# EAGLE design MainHubPCB (EAGLE 9.3.0)
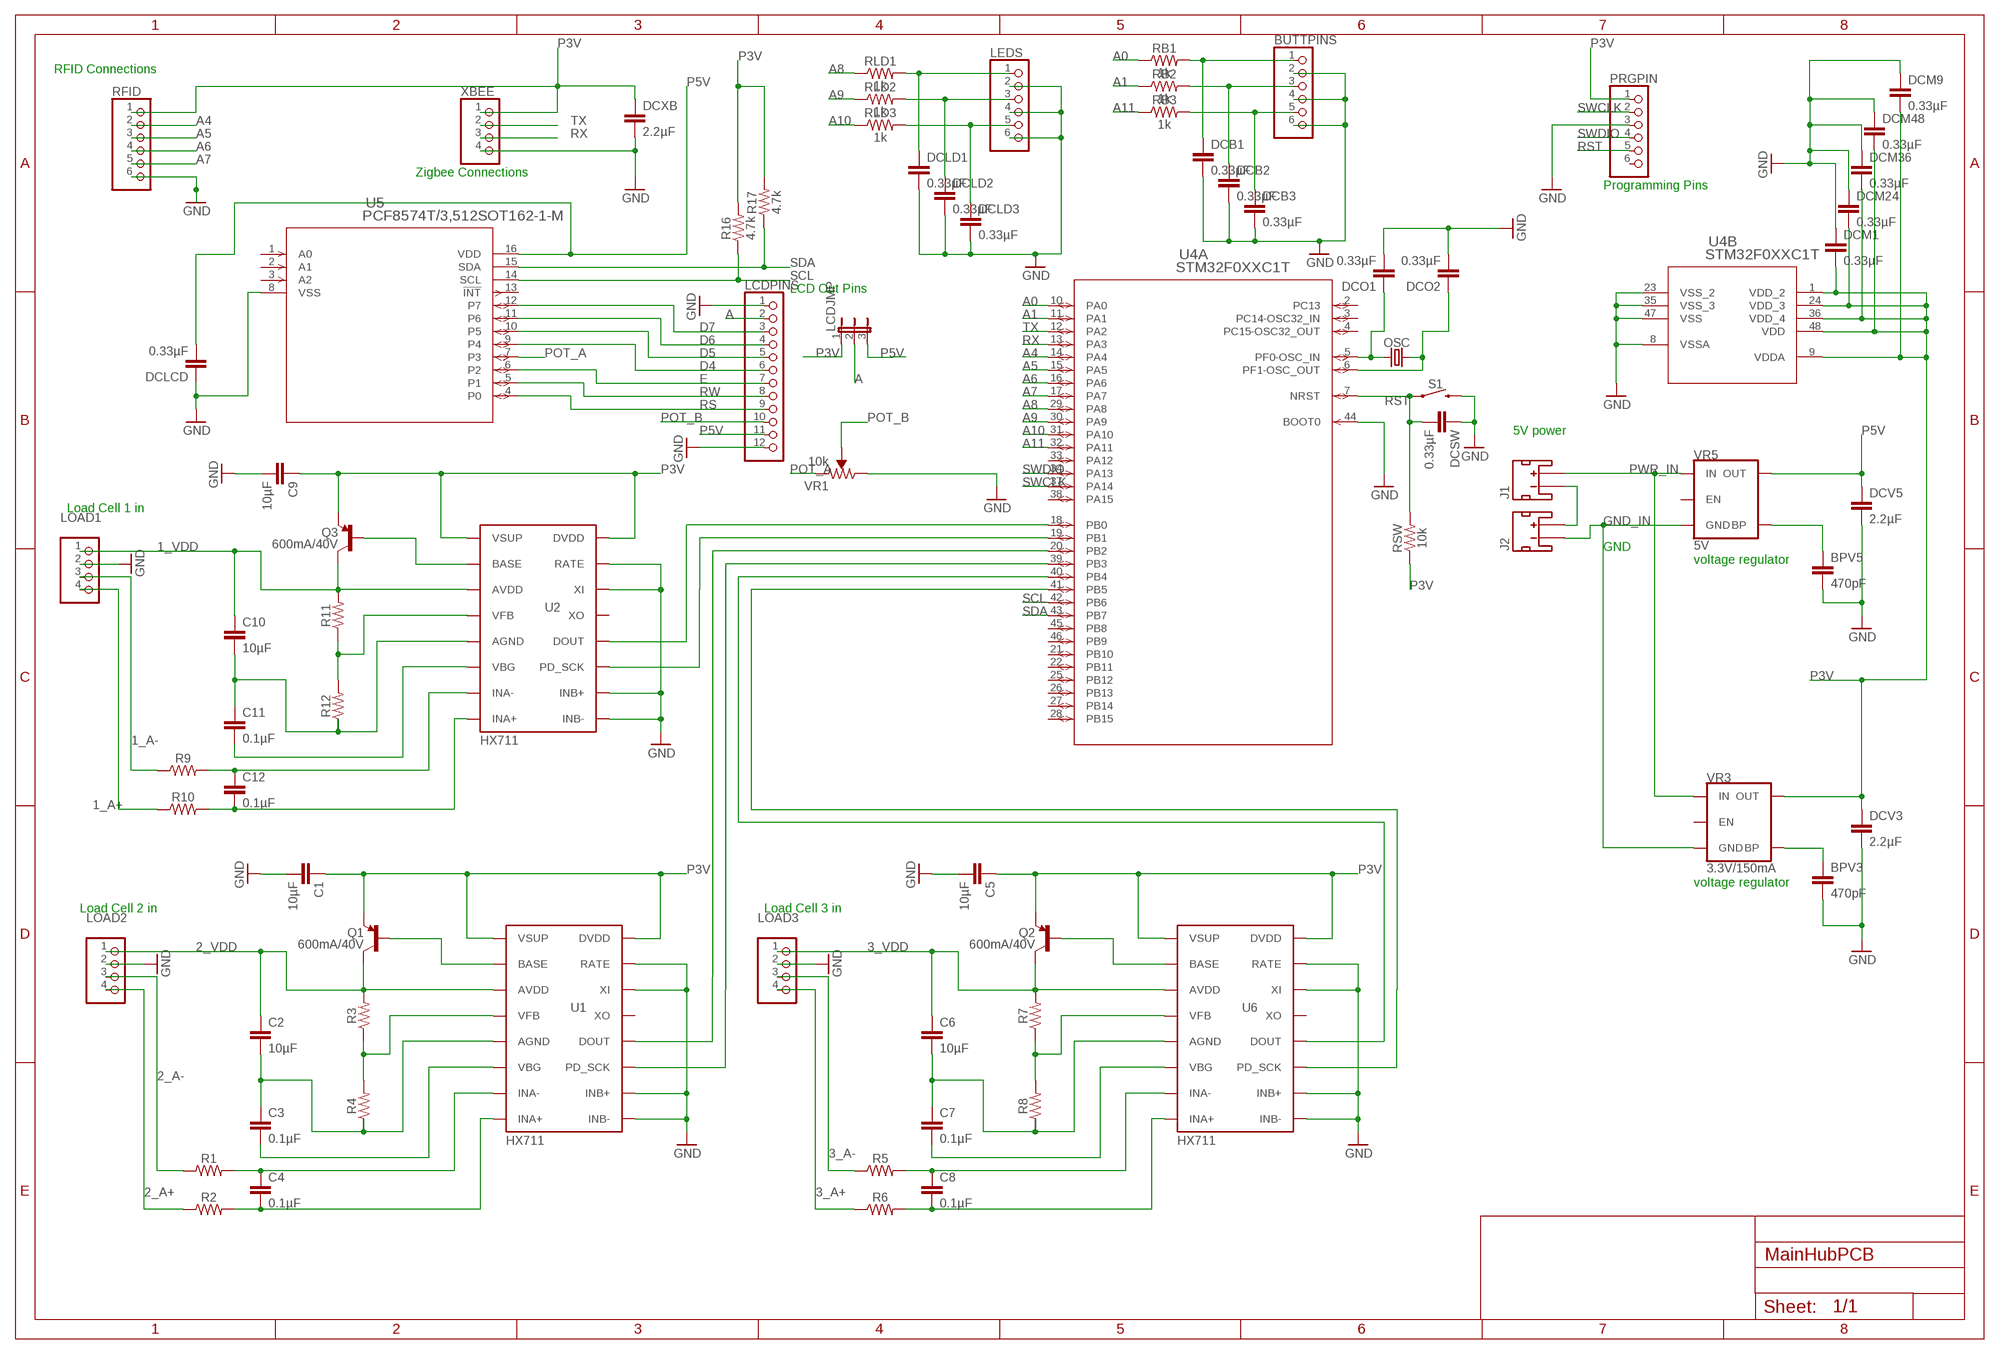
[diagram p0: schematic, sheet 1]

## Parts
BPV3  470pF  0.33UF/330NF-0805-50V-10%  [0805]
BPV5  470pF  0.33UF/330NF-0805-50V-10%  [0805]
BUTTPINS  PINHD-1X6  [1X06]
C1  10µF  0.33UF/330NF-0805-50V-10%  [0805]
C2  10µF  0.33UF/330NF-0805-50V-10%  [0805]
C3  0.1µF  0.33UF/330NF-0805-50V-10%  [0805]
C4  0.1µF  0.33UF/330NF-0805-50V-10%  [0805]
C5  10µF  0.33UF/330NF-0805-50V-10%  [0805]
C6  10µF  0.33UF/330NF-0805-50V-10%  [0805]
C7  0.1µF  0.33UF/330NF-0805-50V-10%  [0805]
C8  0.1µF  0.33UF/330NF-0805-50V-10%  [0805]
C9  10µF  0.33UF/330NF-0805-50V-10%  [0805]
C10  10µF  0.33UF/330NF-0805-50V-10%  [0805]
C11  0.1µF  0.33UF/330NF-0805-50V-10%  [0805]
C12  0.1µF  0.33UF/330NF-0805-50V-10%  [0805]
DCB1  0.33µF  0.33UF/330NF-0805-50V-10%  [0805]
DCB2  0.33µF  0.33UF/330NF-0805-50V-10%  [0805]
DCB3  0.33µF  0.33UF/330NF-0805-50V-10%  [0805]
DCLCD  0.33µF  0.33UF/330NF-0805-50V-10%  [0805]
DCLD1  0.33µF  0.33UF/330NF-0805-50V-10%  [0805]
DCLD2  0.33µF  0.33UF/330NF-0805-50V-10%  [0805]
DCLD3  0.33µF  0.33UF/330NF-0805-50V-10%  [0805]
DCM1  0.33µF  0.33UF/330NF-0805-50V-10%  [0805]
DCM9  0.33µF  0.33UF/330NF-0805-50V-10%  [0805]
DCM24  0.33µF  0.33UF/330NF-0805-50V-10%  [0805]
DCM36  0.33µF  0.33UF/330NF-0805-50V-10%  [0805]
DCM48  0.33µF  0.33UF/330NF-0805-50V-10%  [0805]
DCO1  0.33µF  0.33UF/330NF-0805-50V-10%  [0805]
DCO2  0.33µF  0.33UF/330NF-0805-50V-10%  [0805]
DCSW  0.33µF  0.33UF/330NF-0805-50V-10%  [0805]
DCV3  2.2µF  0.33UF/330NF-0805-50V-10%  [0805]
DCV5  2.2µF  0.33UF/330NF-0805-50V-10%  [0805]
DCXB  2.2µF  0.33UF/330NF-0805-50V-10%  [0805]
J1  JST_2MM_MALE  [JST-2-SMD]
J2  JST_2MM_MALE  [JST-2-SMD]
LCDJMP  JP2E  [JP2]
LCDPINS  PINHD-1X12  [1X12]
LEDS  PINHD-1X6  [1X06]
LOAD1  PINHD-1X4  [1X04]
LOAD2  PINHD-1X4  [1X04]
LOAD3  PINHD-1X4  [1X04]
OSC  CRYSTALPTH-HC49US  [HC49US]
PRGPIN  PINHD-1X6  [1X06]
Q1  600mA/40V  TRANS_PNP-MMBT4403  [SOT23-3]
Q2  600mA/40V  TRANS_PNP-MMBT4403  [SOT23-3]
Q3  600mA/40V  TRANS_PNP-MMBT4403  [SOT23-3]
R1  RESISTOR0805  [0805]
R2  RESISTOR0805  [0805]
R3  RESISTOR0805  [0805]
R4  RESISTOR0805  [0805]
R5  RESISTOR0805  [0805]
R6  RESISTOR0805  [0805]
R7  RESISTOR0805  [0805]
R8  RESISTOR0805  [0805]
R9  RESISTOR0805  [0805]
R10  RESISTOR0805  [0805]
R11  RESISTOR0805  [0805]
R12  RESISTOR0805  [0805]
R16  4.7k  RESISTOR0805  [0805]
R17  4.7k  RESISTOR0805  [0805]
RB1  1k  RESISTOR0805  [0805]
RB2  1k  RESISTOR0805  [0805]
RB3  1k  RESISTOR0805  [0805]
RFID  PINHD-1X6  [1X06]
RLD1  1k  RESISTOR0805  [0805]
RLD2  1k  RESISTOR0805  [0805]
RLD3  1k  RESISTOR0805  [0805]
RSW  10k  RESISTOR0805  [0805]
S1  MOMENTARY-SWITCH-SPST-SMD-5.2MM  [TACTILE_SWITCH_SMD_5.2MM]
U1  HX711  [SO16]
U2  HX711  [SO16]
U4  STM32F0XXC1T  [LQFP48-7X7MM]
U5  PCF8574T/3,512SOT162-1-M  [SOT162-1-M]
U6  HX711  [SO16]
VR1  10k  TRIMPOT-PTH-10MM-KNOB-1/2W-10%  [TRIMPOT-PTH-3386U]
VR3  3.3V/150mA  V_REG_MIC52053.3V  [SOT23-5]
VR5  5V  V_REG_MIC52055V  [SOT23-5]
XBEE  PINHD-1X4  [1X04]

## Nets
1_A+: LOAD1.4 R10.1
1_A-: LOAD1.3 R9.1
1_VDD: C10.1 LOAD1.1 Q3.3(C) R11.2 U2.3(AVDD)
2_A+: LOAD2.4 R2.1
2_A-: LOAD2.3 R1.1
2_VDD: C2.1 LOAD2.1 Q1.3(C) R3.2 U1.3(AVDD)
3_A+: LOAD3.4 R6.1
3_A-: LOAD3.3 R5.1
3_VDD: C6.1 LOAD3.1 Q2.3(C) R7.2 U6.3(AVDD)
A: LCDJMP.2 LCDPINS.2
A0: RB1.1 U4.10(A:PA0)
A1: RB2.1 U4.11(A:PA1)
A4: RFID.2 U4.14(A:PA4)
A5: RFID.3 U4.15(A:PA5)
A6: RFID.4 U4.16(A:PA6)
A7: RFID.5 U4.17(A:PA7)
A8: RLD1.1 U4.29(A:PA8)
A9: RLD2.1 U4.30(A:PA9)
A10: RLD3.1 U4.31(A:PA10)
A11: RB3.1 U4.32(A:PA11)
D4: LCDPINS.6 U5.9(P4)
D5: LCDPINS.5 U5.10(P5)
D6: LCDPINS.4 U5.11(P6)
D7: LCDPINS.3 U5.12(P7)
E: LCDPINS.7 U5.6(P2)
GND: BPV3.2 BPV5.2 BUTTPINS.2 BUTTPINS.4 BUTTPINS.6 C1.2 C5.2 C9.2 DCB1.2 DCB2.2 DCB3.2 DCLCD.1 DCLD1.2 DCLD2.2 DCLD3.2 DCM1.1 DCM9.1 DCM24.1 DCM36.1 DCM48.1 DCO1.2 DCO2.2 DCSW.1 DCV3.2 DCV5.2 DCXB.2 LCDPINS.1 LCDPINS.12 LEDS.2 LEDS.4 LEDS.6 LOAD1.2 LOAD2.2 LOAD3.2 PRGPIN.3 RFID.6 S1.3 U1.9(INB-) U1.10(INB+) U1.14(XI) U1.15(RATE) U2.9(INB-) U2.10(INB+) U2.14(XI) U2.15(RATE) U4.8(B:VSSA) U4.23(B:VSS_2) U4.35(B:VSS_3) U4.44(A:BOOT0) U4.47(B:VSS) U5.8(VSS) U6.9(INB-) U6.10(INB+) U6.14(XI) U6.15(RATE) VR1.3(CW) XBEE.4
GND_IN: J2.1(-) VR3.2(GND) VR5.2(GND)
N$1: J1.1(-) J2.2(+)
N$4: C4.1 R1.2 U1.7(INA-)
N$5: C4.2 R2.2 U1.8(INA+)
N$6: Q1.1(B) U1.2(BASE)
N$8: C2.2 C3.1 R4.1 U1.5(AGND)
N$9: R3.1 R4.2 U1.4(VFB)
N$10: DCLD1.1 LEDS.1 RLD1.2
N$11: C3.2 U1.6(VBG)
N$14: C8.1 R5.2 U6.7(INA-)
N$15: C8.2 R6.2 U6.8(INA+)
N$16: Q2.1(B) U6.2(BASE)
N$18: C6.2 C7.1 R8.1 U6.5(AGND)
N$19: R7.1 R8.2 U6.4(VFB)
N$20: C7.2 U6.6(VBG)
N$21: DCO1.1 OSC.1 U4.5(A:PF0-OSC_IN)
N$22: DCO2.1 OSC.2 U4.6(A:PF1-OSC_OUT)
N$25: C12.1 R9.2 U2.7(INA-)
N$26: C12.2 R10.2 U2.8(INA+)
N$27: Q3.1(B) U2.2(BASE)
N$29: C10.2 C11.1 R12.1 U2.5(AGND)
N$30: R11.1 R12.2 U2.4(VFB)
N$31: C11.2 U2.6(VBG)
N$32: DCLD2.1 LEDS.3 RLD2.2
N$33: DCLD3.1 LEDS.5 RLD3.2
N$34: BPV3.1 VR3.4(BP)
N$35: BUTTPINS.1 DCB1.1 RB1.2
N$36: BUTTPINS.3 DCB2.1 RB2.2
N$37: BPV5.1 VR5.4(BP)
N$38: BUTTPINS.5 DCB3.1 RB3.2
N$54: U4.41(A:PB5) U6.11(PD_SCK)
N$55: U4.40(A:PB4) U6.12(DOUT)
N$56: U1.11(PD_SCK) U4.39(A:PB3)
N$57: U1.12(DOUT) U4.20(A:PB2)
N$58: U2.11(PD_SCK) U4.19(A:PB1)
N$59: U2.12(DOUT) U4.18(A:PB0)
P3V: C1.1 C5.1 C9.1 DCM1.2 DCM9.2 DCM24.2 DCM36.2 DCM48.2 DCV3.1 DCXB.1 LCDJMP.1 PRGPIN.1 Q1.2(E) Q2.2(E) Q3.2(E) R16.2 R17.2 RFID.1 RSW.1 U1.1(VSUP) U1.16(DVDD) U2.1(VSUP) U2.16(DVDD) U4.1(B:VDD_2) U4.9(B:VDDA) U4.24(B:VDD_3) U4.36(B:VDD_4) U4.48(B:VDD) U6.1(VSUP) U6.16(DVDD) VR3.5(OUT) XBEE.1
P5V: DCLCD.2 DCV5.1 LCDJMP.3 LCDPINS.11 U5.16(VDD) VR5.5(OUT)
POT_A: U5.7(P3) VR1.1(CCW)
POT_B: LCDPINS.10 VR1.2(WIPER)
PWR_IN: J1.2(+) VR3.1(IN) VR5.1(IN)
RS: LCDPINS.9 U5.4(P0)
RST: DCSW.2 PRGPIN.5 RSW.2 S1.1 U4.7(A:NRST)
RW: LCDPINS.8 U5.5(P1)
RX: U4.13(A:PA3) XBEE.3
SCL: R16.1 U4.42(A:PB6) U5.14(SCL)
SDA: R17.1 U4.43(A:PB7) U5.15(SDA)
SWCLK: PRGPIN.2 U4.37(A:PA14)
SWDIO: PRGPIN.4 U4.34(A:PA13)
TX: U4.12(A:PA2) XBEE.2
Unconnected: J1.NC1(PAD1) J1.NC2(PAD2) J2.NC1(PAD1) J2.NC2(PAD2) PRGPIN.6 U1.13(XO) U2.13(XO) U4.2(A:PC13) U4.3(A:PC14-OSC32_IN) U4.4(A:PC15-OSC32_OUT) U4.21(A:PB10) U4.22(A:PB11) U4.25(A:PB12) U4.26(A:PB13) U4.27(A:PB14) U4.28(A:PB15) U4.33(A:PA12) U4.38(A:PA15) U4.45(A:PB8) U4.46(A:PB9) U5.1(A0) U5.2(A1) U5.3(A2) U5.13(!INT) U6.13(XO) VR3.3(EN) VR5.3(EN)

## Notes on the sheet
- RFID Connections
- Zigbee Connections
- Programming Pins
- LCD Out Pins
- 5V power
- Load Cell 1 in
- GND
- voltage regulator
- voltage regulator
- Load Cell 2 in | Load Cell 3 in

## Library data of the parts
BPV3 BPV5 C1-C12 DCV3 DCV5 DCXB = SparkFun-Capacitors:0.33UF/330NF: 0.33µF/330nF ceramic capacitors A capacitor is a passive two-terminal electrical component used to store electrical energy temporarily in an electric field.; PROD_ID: CAP-08469; VALUE: 0.33µF
BUTTPINS LEDS PRGPIN RFID = pinhead:PINHD-1X6: PIN HEADER
DCB1-DCB3 DCLCD DCLD1-DCLD3 DCM1 DCM9 DCM24 DCM36 DCM48 DCO1 DCO2 DCSW = SparkFun-Capacitors:0.33UF/330NF: 0.33µF/330nF ceramic capacitors A capacitor is a passive two-terminal electrical component used to store electrical energy temporarily in an electric field.; PROD_ID: CAP-08469
J1 J2 = SparkFun-Connectors:JST_2MM_MALE: JST 2MM MALE RA CONNECTOR Two pin, compact surface mount connector. Commonly used as a battery input connection point. We really like the solid locking feeling and high current rating on these small connectors. We use these all the time as battery connectors. Mates to single-cell LiPo batteries. Here is the connector we sell at SparkFun: JST Right Angle Connector - White <https://www.sparkfun.com/products/8612> (PRT-08612) Datasheet <http://www.sparkfun.com/datasheets/Prototyping/Connectors/JST-Horizontal.pdf> It was used on these SparkFun products: SparkFun MOSFET Power Controller <https://www.sparkfun.com/products/11214> (PRT-11214) SparkFun Battery Babysitter - LiPo Battery Manager <https://www.sparkfun.com/products/13777> (PRT-13777) And many, many others that required a lipo battery connection.; PROD_ID: CONN-11443; SF_ID: PRT-08612
LCDJMP = jumper:JP2E: JUMPER
LCDPINS = pinhead:PINHD-1X12: PIN HEADER
LOAD1-LOAD3 XBEE = pinhead:PINHD-1X4: PIN HEADER
OSC = SparkFun-Clocks:CRYSTAL: Crystals (Generic) These are passive quartz crystals, which can be used as a clock source for a microcontroller. Crystal's are two-terminal devices. They require external "load" capacitors to generate an oscillating signal.
Q1-Q3 = SparkFun-DiscreteSemi:TRANS_PNP: PNP transistor Current controlled devices typically used to amplify current or used as a switch. SparkFun Products: SparkFun Serial Enabled 16x2 LCD - Red on Black <https://www.sparkfun.com/products/9068> SparkFun Logomatic <https://www.sparkfun.com/products/12772>; PROD_ID: TRANS-09245
R1-R12 R16 R17 RB1-RB3 RLD1-RLD3 RSW = SparkFun-Resistors:RESISTOR: Generic Resistor Package
S1 = SparkFun-Switches:MOMENTARY-SWITCH-SPST: Momentary Switch (Pushbutton) - SPST Normally-open (NO) SPST momentary switches (buttons, pushbuttons). Variants PTH-12MM - 12mm square, through-hole Momentary Pushbutton Switch - 12mm Square <https://www.sparkfun.com/products/9190> (COM-09190) PTH-6.0MM, PTH-6.0MM-KIT - 6.0mm square, through-hole Mini Pushbutton Switch <https://www.sparkfun.com/products/97> (COM-00097) KIT package intended for soldering kit's - only one side of pads' copper is exposed. PTH-RIGHT-ANGLE-KIT - Right-angle, through-hole Right Angle Tactile Button <https://www.sparkfun.com/products/10791> - Used on SparkFun BigTime Watch Kit <https://www.sparkfun.com/products/11734> SMD-12MM - 12mm square, surface-mount Tactile Button - SMD (12mm) <https://www.sparkfun.com/products/12993> (COM-12993) Used on SparkFun PicoBoard <https://www.sparkfun.com/products/11888> SMD-4.5MM - 4.5mm Square Trackball Switch Used on SparkFun Blackberry Trackballer Breakout <https://www.sparkfun.com/products/13169> SMD-4.6MMX2.8MM - 4.60mm x 2.80mm, surface mount Used on SparkFun SAMD21 Mini Breakout <https://www.sparkfun.com/products/13664> SMD-5.2MM, SMD-5.2-REDUNDANT - 5.2mm square, surface-mount Mini Pushbutton Switch - SMD <https://www.sparkfun.com/products/8720> (COM-08720) Used on Arduino Pro Mini <https://www.sparkfun.com/products/11114> REDUNDANT package connects both switch circuits together SMD-6.0X3.5MM - 6.0 x 3.5mm, surface mount Momentary Reset Switch SMD <https://www.sparkfun.com/products/8229> (COM-08229) SMD-6.2MM-TALL - 6.2mm square, surface mount Tactile Button - SMD (6mm) <https://www.sparkfun.com/products/12992> Used on SparkFun Digital Sandbox <https://www.sparkfun.com/products/12651> SMD-RIGHT-ANGLE - Right-angle, surface mount Used on SparkFun Block for Intel® Edison - Arduino <https://www.sparkfun.com/products/13036>; PROD_ID: SWCH-08247; SF_SKU: COM-08720
U1 U2 U6 = SparkFun-IC-Conversion:HX711: AVIA Semiconductor HX711 - ADC 24-Bit Analog-to-Digital Converter for Weigh Scales Datasheet <https://cdn.sparkfun.com/datasheets/Sensors/ForceFlex/hx711_english.pdf> SparkFun Products: SparkFun Load Cell Amplifier - HX711 <https://www.sparkfun.com/products/13879>; PROD_ID: IC-12445
U4 = ECE477_Resources:STM32F0XXC1T; MANUFACTURER_PART_NUMBER: stm32f0xxc1t; VENDOR: STMicroelectronics
U5 = ECE477_Resources:PCF8574T/3,512; MANUFACTURER_PART_NUMBER: PCF8574T3512; VENDOR: NXP
VR1 = SparkFun-Resistors:TRIMPOT: Trimming Potentiometer (Trimpot) Three-terminal potentiometers, with an adjustable wiper and two adjustable resistors. A pot can be used to create a configurable voltage divider, or as a variable resistor. "Trimpots" are a subset of potentiometers, usually intended for "set-and-forget" applications. They're often more delicate than standard potentiometers - rated for fewer turns. Variants PTH-KNOB - PTH Trimpot w/ finger-adjustable knob Trimpot 10K with Knob <https://www.sparkfun.com/products/9806> (COM-09806) Datasheet <http://www.sparkfun.com/datasheets/Components/General/TSR-3386.pdf> SMD-3MM-CLOSED-FRAME - SMD 3mm Square Closed-Frame Trimpot Used on e.g. EasyDriver - Stepper Motor Driver <https://www.sparkfun.com/products/12779> Datasheet <http://www.bitechnologies.com/pdfs/22.pdf> (22AR10KTR) SMD-5MM - SMD 5mm Square Closed-Frame Trimpot Used on e.g. IOIO-OTG - V2.2 <https://www.sparkfun.com/products/13613> Datasheet <http://www.vishay.com/docs/51008/ts53.pdf> (TS53YL502MR10) SMD-3MM-1/10W-25% - 3mm Square Open-Frame Trimpot Used on e.g. SparkFun Shapeoko <https://www.sparkfun.com/products/13899> Datasheet <http://www.bourns.com/docs/Product-Datasheets/TC33.pdf> (TC33X-2-103E); PROD_ID: RES-09730; SF_SKU: COM-09806
VR3 = SparkFun-IC-Power:V_REG_MIC5205: V_REG MIC5205 Standard 3.3V, 5V, and Adjustable 150mA LDO voltage regulator in SOT-23 layout. Micrel part MIC5205. BP (by-pass) pin is used to lower output noise with 470pF cap, may be left open. On the adjustable version BP is used to set output.; PROD_ID: VREG-00822
VR5 = SparkFun-IC-Power:V_REG_MIC5205: V_REG MIC5205 Standard 3.3V, 5V, and Adjustable 150mA LDO voltage regulator in SOT-23 layout. Micrel part MIC5205. BP (by-pass) pin is used to lower output noise with 470pF cap, may be left open. On the adjustable version BP is used to set output.; PROD_ID: VREG-00823

## Board
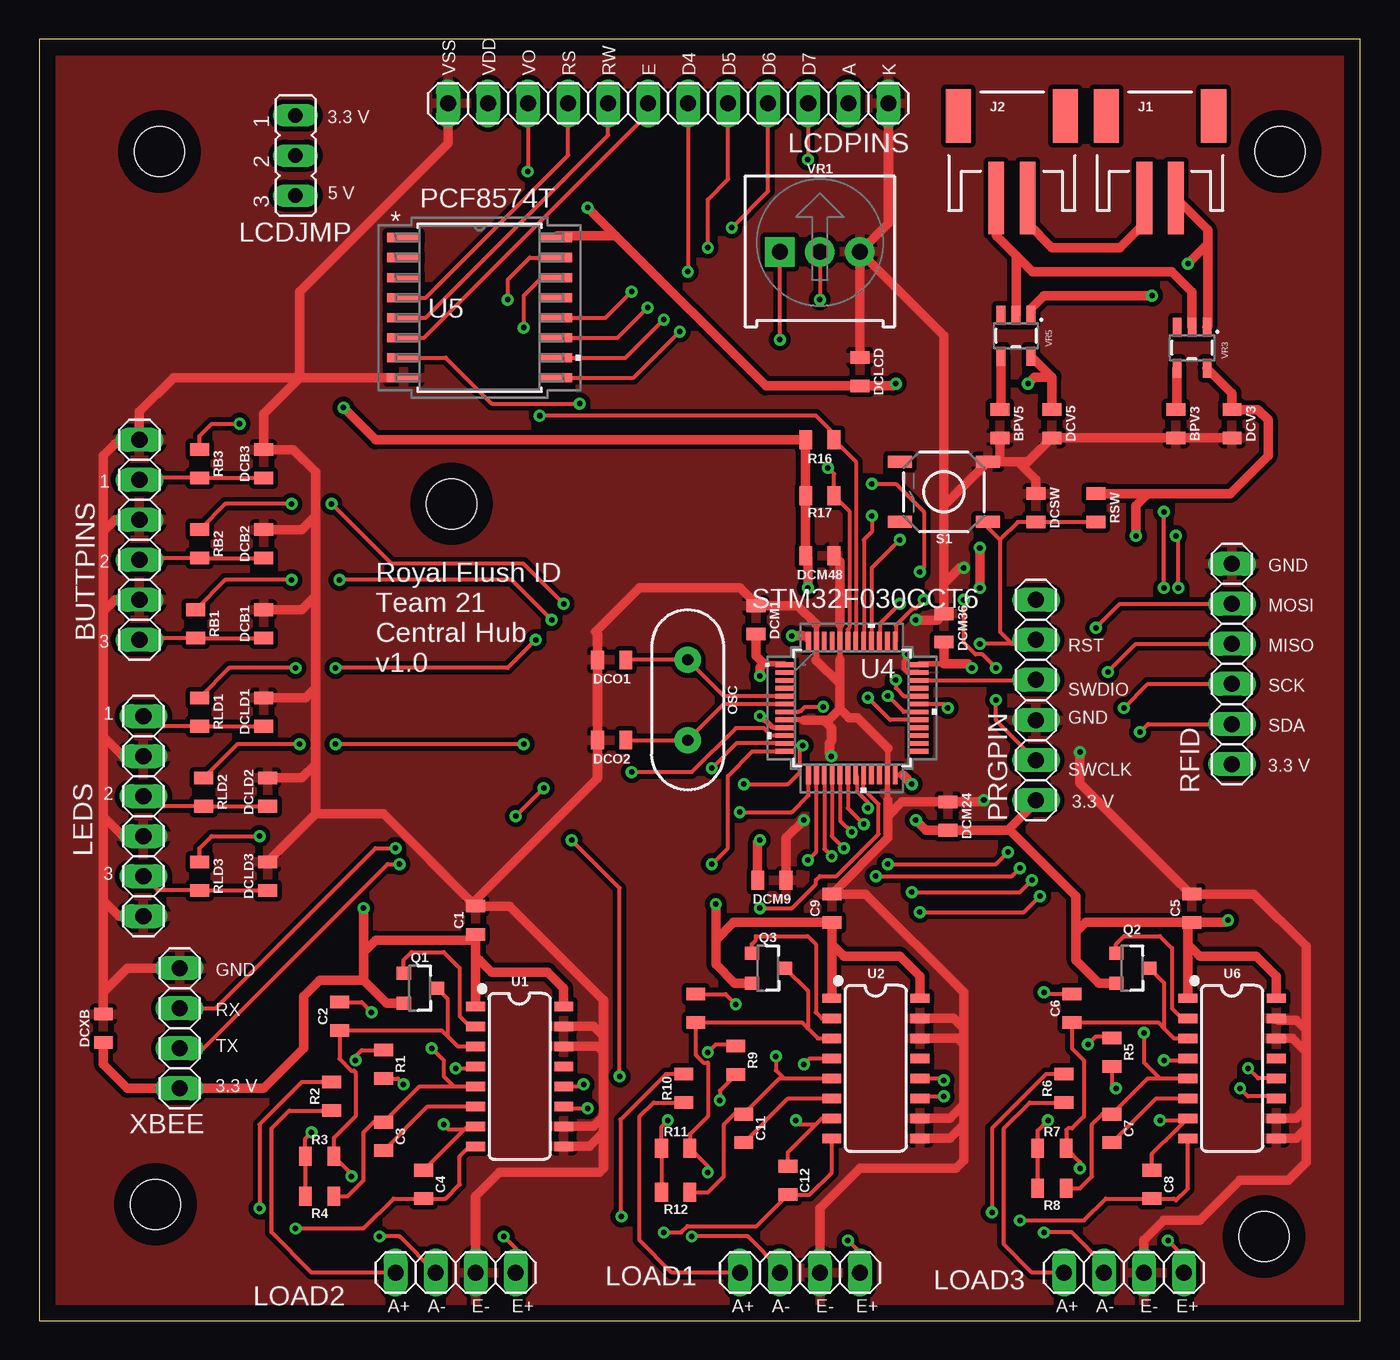
[diagram p1: board, top side]
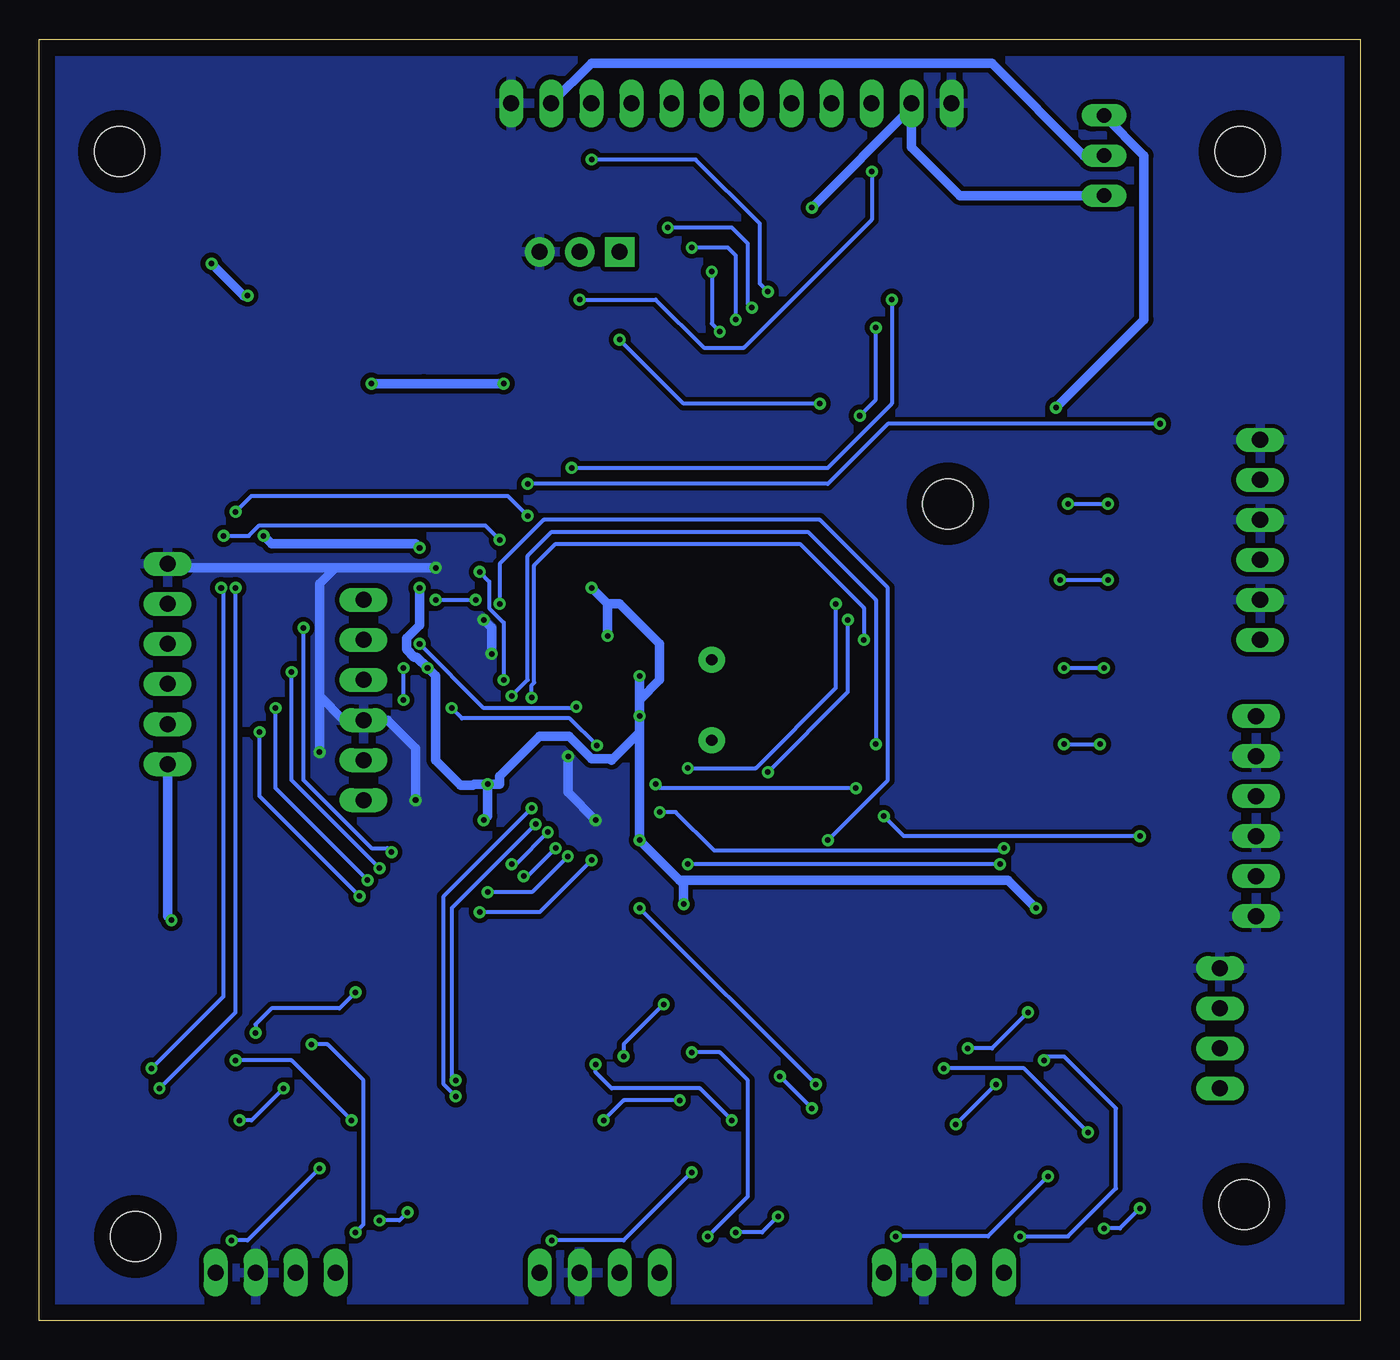
[diagram p2: board, bottom side, seen from below]

Size 83.82 x 81.28 mm. Coordinates in mm from the lower left corner, seen from the top.
Outline: 0,0 83.82,0 83.82,81.28 0,81.28 0,0
Copper layers (1*16): Top 0.035mm / dielectric 1.5mm / Bottom 0.035mm
Design rules "default": minimum track width 6mil, minimum drill 0.35mm, track to track 6mil, track to pad 6mil, pad to pad 6mil, via to via 6mil, smd to smd 6mil, copper to edge 40mil, drill to drill 6mil, minimum pad ring 10mil, minimum via ring 8mil, stop-mask expansion 4mil, vias tented up to drill 0mil, thermal gap 10mil
Holes 3.17 mm at 7.62,74.17 7.37,7.37 77.72,5.33 78.74,74.17 26.16,51.82

### Footprints (pad centres in the part's own frame; a part is rotated, then mirrored left to right if it is on the bottom)
0805 = smd 0.8 x 1.2: 1 -0.9,0; 2 0.9,0
1X06 = drill 1.016 long: 1 -6.35,0; 2 -3.81,0; 3 -1.27,0; 4 1.27,0; 5 3.81,0; 6 6.35,0
JST-2-SMD = smd 1 x 4.6: 1 -1,-3.7; 2 1,-3.7 | smd 1.6 x 3.4: NC1 -3.4,1.5; NC2 3.4,1.5
JP2 = drill 0.914 long: 1 -2.54,0; 2 0,0; 3 2.54,0
1X12 = drill 1.016 long: 1 -13.97,0; 2 -11.43,0; 3 -8.89,0; 4 -6.35,0; 5 -3.81,0; 6 -1.27,0; 7 1.27,0; 8 3.81,0; 9 6.35,0; 10 8.89,0; 11 11.43,0; 12 13.97,0
1X04 = drill 1.016 long: 1 -3.81,0; 2 -1.27,0; 3 1.27,0; 4 3.81,0
HC49US = drill 0.7 pad 1.651: 1 -2.54,0; 2 2.54,0
SOT23-3 = smd 0.8 x 0.9: 1 -0.95,-1; 2 0.95,-1; 3 0,1.1
TACTILE_SWITCH_SMD_5.2MM = smd 1.524 x 0.762: 1 -2.794,1.905; 2 2.794,1.905; 3 -2.794,-1.905; 4 2.794,-1.905
SO16 = smd 0.6 x 1.2: 1 -4.445,-2.8; 2 -3.175,-2.8; 3 -1.905,-2.8; 4 -0.635,-2.8; 5 0.635,-2.8; 6 1.905,-2.8; 7 3.175,-2.8; 8 4.445,-2.8; 9 4.445,2.8; 10 3.175,2.8; 11 1.905,2.8; 12 0.635,2.8; 13 -0.635,2.8; 14 -1.905,2.8; 15 -3.175,2.8; 16 -4.445,2.8
LQFP48-7X7MM = smd 1.194 x 0.305: 1 -4.25,2.75; 2 -4.25,2.25; 3 -4.25,1.75; 4 -4.25,1.25; 5 -4.25,0.75; 6 -4.25,0.25; 7 -4.25,-0.25; 8 -4.25,-0.75; 9 -4.25,-1.25; 10 -4.25,-1.75; 11 -4.25,-2.25; 12 -4.25,-2.75; 25 4.25,-2.75; 26 4.25,-2.25; 27 4.25,-1.75; 28 4.25,-1.25; 29 4.25,-0.75; 30 4.25,-0.25; 31 4.25,0.25; 32 4.25,0.75; 33 4.25,1.25; 34 4.25,1.75; 35 4.25,2.25; 36 4.25,2.75 | smd 0.305 x 1.194: 13 -2.75,-4.25; 14 -2.25,-4.25; 15 -1.75,-4.25; 16 -1.25,-4.25; 17 -0.75,-4.25; 18 -0.25,-4.25; 19 0.25,-4.25; 20 0.75,-4.25; 21 1.25,-4.25; 22 1.75,-4.25; 23 2.25,-4.25; 24 2.75,-4.25; 37 2.75,4.25; 38 2.25,4.25; 39 1.75,4.25; 40 1.25,4.25; 41 0.75,4.25; 42 0.25,4.25; 43 -0.25,4.25; 44 -0.75,4.25; 45 -1.25,4.25; 46 -1.75,4.25; 47 -2.25,4.25; 48 -2.75,4.25
SOT162-1-M = smd 2.108 x 0.584: 1 -4.826,4.445; 2 -4.826,3.175; 3 -4.826,1.905; 4 -4.826,0.635; 5 -4.826,-0.635; 6 -4.826,-1.905; 7 -4.826,-3.175; 8 -4.826,-4.445; 9 4.826,-4.445; 10 4.826,-3.175; 11 4.826,-1.905; 12 4.826,-0.635; 13 4.826,0.635; 14 4.826,1.905; 15 4.826,3.175; 16 4.826,4.445
TRIMPOT-PTH-3386U = drill 1.016 pad 1.88 square: 1 -2.54,-0.015 | drill 1.016 pad 1.88: 2 0,-0.015; 3 2.54,-0.015
SOT23-5 = smd 0.55 x 1.2: 1 -0.95,-1.3; 2 0,-1.3; 3 0.95,-1.3; 4 0.95,1.3; 5 -0.95,1.3

### Placement (x,y rotation side)
BPV3  72.14,56.9 270 top
BPV5  60.96,56.9 270 top
BUTTPINS  6.35,49.53 90 top
C1  27.69,25.4 90 top
C2  19.05,19.3 90 top
C3  21.84,11.68 270 top
C4  24.38,8.64 270 top
C5  73.15,26.16 90 top
C6  65.53,19.81 90 top
C7  68.07,12.19 270 top
C8  70.61,8.64 270 top
C9  50.29,26.16 90 top
C10  41.66,19.81 90 top
C11  44.7,12.19 270 top
C12  47.5,8.89 270 top
DCB1  14.22,44.2 90 top
DCB2  14.22,49.28 90 top
DCB3  14.22,54.36 90 top
DCLCD  52.07,60.2 270 top
DCLD1  14.22,38.61 90 top
DCLD2  14.48,33.53 90 top
DCLD3  14.48,28.19 90 top
DCM1  45.47,44.45 270 top
DCM9  46.48,27.94 180 top
DCM24  57.66,32 270 top
DCM36  57.4,43.94 270 top
DCM48  49.53,48.51 180 top
DCO1  36.32,41.91 180 top
DCO2  36.32,36.83 180 top
DCSW  63.25,51.56 270 top
DCV3  75.69,56.9 270 top
DCV5  64.26,56.9 270 top
DCXB  4.06,18.54 90 top
J1  71.12,74.93 0 top
J2  61.72,74.93 0 top
LCDJMP  16.26,73.91 270 top
LCDPINS  39.9,77.22 180 top
LEDS  6.6,32 270 top
LOAD1  48.26,3.05 180 top
LOAD2  26.42,3.05 180 top
LOAD3  68.83,3.05 180 top
OSC  41.15,39.37 270 top
PRGPIN  63.25,39.37 90 top
Q1  24.13,21.08 270 top
Q2  69.34,22.35 270 top
Q3  46.23,22.35 270 top
R1  21.84,16.26 270 top
R2  18.54,14.22 90 top
R3  17.78,10.41 0 top
R4  17.78,7.87 180 top
R5  68.07,17.02 270 top
R6  65.02,14.73 90 top
R7  64.26,10.92 0 top
R8  64.26,8.38 180 top
R9  44.2,16.51 270 top
R10  40.89,14.73 90 top
R11  40.39,10.92 0 top
R12  40.39,8.13 180 top
R16  49.53,55.88 180 top
R17  49.53,52.32 180 top
RB1  9.91,44.2 270 top
RB2  10.16,49.28 270 top
RB3  10.16,54.36 270 top
RFID  75.69,41.66 90 top
RLD1  10.16,38.61 270 top
RLD2  10.41,33.53 270 top
RLD3  10.16,28.19 270 top
RSW  67.06,51.56 270 top
S1  57.4,52.58 180 top
U1  30.48,15.49 270 top
U2  53.09,16 270 top
U4  51.56,38.86 0 top
U5  27.94,64.26 0 top
U6  75.69,16 270 top
VR1  49.53,67.82 0 top
VR3  73.15,61.72 180 top
VR5  61.98,62.48 180 top
XBEE  8.89,18.54 90 top

### Tracks (layer width: path | path; a pad name or v marks a point on that pad's centre or on a via)
1_A+
  Top 0.254: LOAD1.4 40.13,3.05 38.1,5.08 38.1,12.95 38.98,13.83 R10.1
1_A-  (via drill 0.35)
  Top 0.254: LOAD1.3 46.99,3.3 44.96,5.33 v41.4,5.33 | v42.42,17.02 42.93,17.53 44.08,17.53 R9.1
  Bottom 0.254: v41.4,5.33 38.86,7.87 38.86,15.24 40.64,17.02 v42.42,17.02
1_VDD  (via drill 0.35)
  Top 0.254: Q3.3 48.77,20.91 48.77,18.54 | 48.77,18.54 49.4,17.91 U2.3 | 48.77,18.54 48.4,18.91 C10.1 41.66,16.85 42.15,16.36 42.42,16.36 42.42,12.95 41.29,11.82 R11.2 42.42,9.79 v42.42,9.4 | v51.31,5.08 52.07,4.32 LOAD1.1
  Bottom 0.254: v42.42,9.4 46.74,5.08 v51.31,5.08
2_A+
  Top 0.254: LOAD2.4 17.27,3.05 14.73,5.59 14.73,12.19 15.86,13.32 R2.1
2_A-  (via drill 0.35)
  Top 0.254: LOAD2.3 22.86,5.33 v21.59,5.33 | v20.07,16.51 20.07,16.76 20.46,17.16 R1.1
  Bottom 0.254: v21.59,5.33 18.54,5.33 15.49,8.38 15.49,13.46 18.8,16.76 19.81,16.76 v20.07,16.51
2_VDD  (via drill 0.35)
  Top 0.254: Q1.3 25.91,20.4 25.91,18.03 | 25.91,18.03 26.54,17.4 U1.3 | 25.91,18.03 25.54,18.4 C2.1 19.05,16.6 19.79,15.85 19.96,15.85 20.07,15.75 20.07,12.95 18.68,11.57 R3.2 19.81,9.28 v19.81,9.14 | v29.46,5.33 30.23,4.57 LOAD2.1
  Bottom 0.254: v19.81,9.14 23.62,5.33 v29.46,5.33
3_A+
  Top 0.254: LOAD3.4 62.99,3.05 61.21,4.83 61.21,12.19 62.85,13.83 R6.1
3_A-  (via drill 0.35)
  Top 0.254: LOAD3.3 67.56,3.56 65.53,5.59 v63.75,5.59 | v66.55,17.53 67.06,18.03 67.96,18.03 R5.1
  Bottom 0.254: v63.75,5.59 63.25,6.1 63.25,15.24 65.53,17.53 v66.55,17.53
3_VDD  (via drill 0.35)
  Top 0.254: Q2.3 71.37,21.42 71.37,18.54 | 71.37,18.54 72.01,17.91 U6.3 | 71.37,18.54 71,18.91 C6.1 65.53,17.27 66.29,16.51 66.29,12.95 65.53,12.19 65.28,12.19 65.16,12.08 R7.2 66.04,10.04 v66.04,9.65 | v71.63,5.08 72.64,4.06 LOAD3.1
  Bottom 0.254: v66.04,9.65 70.61,5.08 v71.63,5.08
A
  Bottom 0.61: LCDJMP.2 17.53,73.91 23.37,79.76 48.79,79.76 LCDPINS.2
A0  (via drill 0.35)
  Top 0.254: U4.10 46.45,37.11 45.97,37.59 44.2,37.59 41.4,34.8 v37.59,34.8 | v32.51,44.45 29.97,46.99 v19.05,46.99 | v16,46.99 11.8,46.99 RB1.1
  Bottom 0.254: v37.59,34.8 32.51,39.88 v32.51,44.45 | v19.05,46.99 v16,46.99
A1  (via drill 0.35)
  Top 0.254: U4.11 44.23,36.61 v42.67,35.05 | v33.27,45.47 30.73,48.01 22.35,48.01 v18.54,51.82 | v16,51.82 11.8,51.82 RB2.1
  Bottom 0.254: v42.67,35.05 38.35,35.05 33.27,40.13 v33.27,45.47 | v18.54,51.82 v16,51.82
A4  (via drill 0.35)
  Top 0.254: U4.14 49.28,34.58 49.28,29.72 v48.77,29.21 | v55.88,25.91 62.48,25.91 v63.5,26.92 | v69.85,37.34 70.36,37.85 RFID.2
  Bottom 0.254: v48.77,29.21 52.07,25.91 v55.88,25.91 | v63.5,26.92 69.85,33.27 v69.85,37.34
A5  (via drill 0.35)
  Top 0.254: U4.15 49.81,29.93 v50.28,29.46 | v55.37,27.18 62.23,27.18 v62.99,27.94 | v68.83,38.86 70.36,40.39 RFID.3
  Bottom 0.254: v50.28,29.46 52.56,27.18 v55.37,27.18 | v62.99,27.94 68.83,33.78 v68.83,38.86
A6  (via drill 0.35)
  Top 0.254: U4.16 50.29,34.59 50.29,30.73 v51.05,29.97 | v53.09,28.19 61.72,28.19 v62.23,28.7 | v67.82,41.15 69.6,42.93 RFID.4
  Bottom 0.254: v51.05,29.97 52.83,28.19 v53.09,28.19 | v62.23,28.7 67.82,34.29 v67.82,41.15
A7  (via drill 0.35)
  Top 0.254: U4.17 50.81,31.72 v51.55,30.98 | v53.85,28.96 60.71,28.96 v61.47,29.72 | v67.06,43.94 68.58,45.47 RFID.5
  Bottom 0.254: v51.55,30.98 53.58,28.96 v53.85,28.96 | v61.47,29.72 61.72,29.97 62.74,29.97 67.06,34.29 v67.06,43.94
A8  (via drill 0.35)
  Top 0.254: U4.29 53.99,38.11 v52.58,39.52 | v31.5,43.18 29.72,41.4 v18.8,41.4 | v16.26,41.4 12.05,41.4 RLD1.1
  Bottom 0.254: v52.58,39.52 52.58,40.32 52.43,40.47 52.43,47.9 51.05,49.28 35.56,49.28 31.5,45.21 v31.5,43.18 | v18.8,41.4 v16.26,41.4
A9  (via drill 0.35)
  Top 0.254: U4.30 54.86,38.61 v53.85,39.62 | v30.73,36.58 v18.8,36.58 | v16.51,36.58 12.56,36.58 RLD2.1
  Bottom 0.254: v53.85,39.62 52.83,40.64 52.83,48.51 51.31,50.04 35.05,50.04 30.73,45.72 30.73,36.83 30.48,36.58 v30.73,36.58 | v18.8,36.58 v16.51,36.58
A10  (via drill 0.35)
  Top 0.254: RLD3.1 10.16,29.97 10.92,30.73 v13.97,30.73 | v30.23,32 v32,33.78 | v44.7,34.04 47.5,34.04 48.26,34.8 48.26,36.32 48.42,36.48 v48.44,36.48 | v57.66,38.86 57.41,39.11 U4.31
  Bottom 0.254: v13.97,30.73 28.96,30.73 v30.23,32 | v32,33.78 44.45,33.78 v44.7,34.04 | v48.44,36.48 50.16,38.2 57,38.2 v57.66,38.86
A11  (via drill 0.35)
  Top 0.254: RB3.1 10.16,56.13 10.92,56.9 v12.7,56.9 | v54.36,40.64 54.36,40.13 54.88,39.61 U4.32 | v52.83,53.09 54.36,53.09 56.13,51.31 56.13,47.75 v55.88,47.5
  Bottom 0.254: v12.7,56.9 29.97,56.9 33.78,53.09 v52.83,53.09 | v54.36,40.64 54.36,44.28 55.27,45.19 55.27,46.89 v55.88,47.5
D4  (via drill 0.35)
  Top 0.254: U5.9 37.72,59.82 v40.64,62.74 | LCDPINS.6 41.17,66.57 v41.15,66.55
  Bottom 0.254: v41.15,66.55 41.15,63.25 v40.64,62.74
D5  (via drill 0.35)
  Top 0.254: U5.10 37.21,61.09 v39.62,63.5 | v42.42,68.07 42.42,71.12 43.71,72.42 LCDPINS.5
  Bottom 0.254: v39.62,63.5 39.62,67.56 40.13,68.07 v42.42,68.07
D6  (via drill 0.35)
  Top 0.254: U5.11 36.7,62.36 v38.61,64.26 | v43.94,69.34 46.25,71.65 LCDPINS.4
  Bottom 0.254: v38.61,64.26 38.86,64.52 38.86,68.33 39.88,69.34 v43.94,69.34
D7  (via drill 0.35)
  Top 0.254: U5.12 35.94,63.63 v37.59,65.28 | LCDPINS.3 48.79,73.69 v48.77,73.66
  Bottom 0.254: v37.59,65.28 38.1,65.79 38.1,69.6 42.16,73.66 v48.77,73.66
E
  Top 0.254: U5.6 24.42,62.36 38.63,76.57 LCDPINS.7
GND  (via drill 0.35)
  Top 0.305: U4.35 55.8,41.13 55.11,41.13 54.91,41.33 54.91,41.89 55.12,42.1 v55.12,42.3 | 48.51,38.1 48.5,38.11 U4.8
  Top 0.356: 53.85,33.02 53.81,33.06 U4.23 53.83,34.63 53.83,35.35 53.85,35.36 53.85,36.32 | 50.81,41.92 U4.44 50.81,44.18 | 49.28,44.2 49.31,44.16 U4.47 49.31,41.91 49.3,41.89
  Top 0.61: 57.4,51.69 S1.3 60.96,54.48 | 57.4,51.69 57.4,46.74 | 57.4,46.74 DCM36.1 57,44.44 55.64,44.44 v55.63,44.45 | v58.67,47.75 58.42,47.75 57.4,46.74 | v59.94,33.02 59.83,32.9 DCM24.1 54.75,32.9 53.85,32 | 60.96,54.48 62.1,54.48 | DCSW.1 63.25,53.34 62.1,54.48 | U5.8 16.51,59.82 | 16.51,59.82 8.51,59.82 6.35,57.66 BUTTPINS.6 6.1,55.63 4.83,55.63 4.06,54.86 4.06,50.04 | 17.53,51.05 17.53,53.85 16.12,55.26 DCB3.2 14.22,57.53 16.51,59.82 | 17.53,51.05 17.53,45.97 | 17.53,45.97 17.53,40.13 | 17.53,40.13 17.53,35.31 | 17.53,35.31 17.53,32.14 | 17.53,32.14 DCLD3.2 | C1.2 27.69,26.67 35.42,34.41 DCO2.2 DCO1.2 35.42,43.57 35.31,43.69 38.1,46.48 44.45,46.48 45.47,45.47 DCM1.1 48.12,45.35 49.28,44.2 | DCLD2.2 16.65,34.43 17.53,35.31 | DCLD1.2 16.9,39.51 17.53,40.13 | DCB1.2 16.65,45.1 17.53,45.97 | DCB2.2 16.65,50.18 17.53,51.05 | XBEE.4 5.59,22.35 4.06,20.83 | 4.06,20.83 DCXB.2 | 4.06,44.96 4.06,37.08 | 4.06,37.08 4.06,32 | 4.06,32 4.06,26.67 | 4.06,26.67 4.06,20.83 | BUTTPINS.2 4.83,45.72 4.06,44.96 | BUTTPINS.4 4.83,50.8 4.06,50.04 | 4.06,50.04 4.06,44.96 | U1.15 35.18,18.67 35.81,18.03 | 35.81,18.03 35.81,17.02 | 35.81,17.02 35.81,12.95 | 35.81,12.95 35.81,11.94 | U1.9 34.92,11.05 35.81,11.94 | U1.10 35.18,12.32 35.81,12.95 | U1.14 35.43,17.4 35.81,17.02 | U6.15 78.62,19.05 79.76,19.05 80.39,18.41 | 80.39,18.41 80.39,17.02 | 80.39,17.02 80.39,13.46 | 80.39,13.46 80.39,12.19 | 80.39,12.19 79.76,11.56 U6.9 | U6.10 79.76,12.83 80.39,13.46 | U6.14 79.5,17.91 80.39,17.02 | U2.9 57.78,11.56 58.67,12.45 | 58.67,12.45 58.67,13.72 | 58.67,13.72 58.67,17.53 | 58.67,17.53 58.67,18.54 | 58.67,18.54 58.04,19.18 U2.15 | U2.14 58.29,17.91 58.67,17.53
  Top 0.61: 35.81,18.03 35.81,20.32 29.83,26.3 C1.2 | C1.2 21.84,32.14 17.53,32.14 | 53.85,32 53.85,30.62 C9.2 52.44,27.06 58.67,20.83 58.67,18.54 | 53.85,33.02 53.85,32 | 80.39,18.41 80.39,23.75 77.08,27.06 C5.2 73.06,27.06 66.04,34.09 v66.04,36.07 | BPV5.2 60.96,54.48 | 62.1,54.48 62.75,54.48 DCV5.2 BPV3.2 DCV3.2 | VR1.3 57.4,62.47 57.4,51.69 | U2.10 57.78,12.83 58.67,13.72 | VR1.3 DCLCD.1 | 80.39,12.19 80.39,10.03 79.25,8.89 76.2,8.89 73.66,6.35 71.37,6.35 70.1,5.08 LOAD3.2 | 58.67,12.45 58.67,10.16 58.17,9.65 52.07,9.65 49.53,7.11 LOAD1.2 | 35.81,11.94 35.81,9.65 35.56,9.4 29.21,9.4 27.69,7.87 LOAD2.2 | 53.85,36.32 51.93,38.24 51.39,38.24 50.81,38.82 | 49.3,41.89 50.8,40.39 50.8,39.62 50.81,39.64 | 50.81,41.92 50.81,39.64 | DCM48.1 50.81,48.13 50.81,44.18 | LEDS.2 5.33,35.81 4.06,37.08 | LEDS.4 5.33,30.73 4.06,32 | LEDS.6 5.08,25.65 4.06,26.67 | DCM9.1 47.38,30.62 v48.51,31.75 | 49.78,38.1 50.27,37.62 50.27,36.75 50.15,36.64 50.15,36.01 50.27,35.89 v50.27,35.79 | 49.78,38.1 49.02,38.1 48.51,38.1 | 49.78,38.1 50.09,38.1 50.81,38.82 | 50.81,39.64 50.81,38.82 | LCDPINS.1 53.87,69.61 VR1.3 | 16.51,59.82 16.51,65.28 25.93,74.7 LCDPINS.12
  Bottom 0.61: 66.04,39.62 64.52,38.1 PRGPIN.3 61.72,38.1 59.94,36.32 v59.94,33.02 | 66.04,39.62 66.04,46.74 65.02,47.75 | 65.02,47.75 v58.67,47.75 | v66.04,36.07 66.04,39.62 | RFID.6 75.44,47.75 65.02,47.75 | v55.12,42.3 55.12,43.94 v55.63,44.45 | v48.51,31.75 50.27,33.5 v50.27,35.79
  pour Top (isolate 0.305): 0.76,80.26 83.06,80.26 83.06,0.76 0.76,0.76
  pour Bottom (isolate 0.305): 0.76,80.26 83.06,80.26 83.06,0.76 0.76,0.76
GND_IN
  Top 0.61: J2.1 60.72,68.83 61.99,67.56 | 61.99,67.56 61.99,63.8 VR5.2 | VR3.2 73.15,65.28 71.88,66.55 63.01,66.55 61.99,67.56
N$1
  Top 0.61: J1.1 70.12,69.61 68.58,68.07 64.26,68.07 62.72,69.61 J2.2
N$4  (via drill 0.35)
  Top 0.254: C4.1 26.98,12.13 | 26.98,12.13 27.17,12.32 U1.7 | R1.2 22.74,15.36 v23.11,14.99 | v25.65,12.45 25.97,12.13 26.98,12.13
  Bottom 0.254: v23.11,14.99 v25.65,12.45
N$5  (via drill 0.35)
  Top 0.254: U1.8 27.3,11.05 26.67,10.41 26.67,8.64 25.77,7.74 C4.2 22.47,7.74 20.57,5.84 v16.26,5.84 | R2.2 16.65,15.12 13.97,12.45 v13.97,7.11
  Bottom 0.254: v13.97,7.11 15.24,5.84 v16.26,5.84
N$6
  Top 0.254: Q1.1 23.13,22.88 23.62,23.37 25.65,23.37 26.67,22.35 26.67,19.3 27.3,18.67 U1.2
N$8  (via drill 0.35)
  Top 0.254: C3.1 22.03,12.77 | 22.03,12.77 24.12,14.86 26.29,14.86 | 26.29,14.86 U1.5 | C2.2 20.44,20.2 v21.08,19.56 | v24.89,17.27 25.65,16.51 25.65,15.49 26.29,14.86 | R4.1 19.56,7.87 20.57,8.89 20.57,11.94 21.41,12.77 22.03,12.77
  Bottom 0.254: v21.08,19.56 23.37,17.27 v24.89,17.27
N$9  (via drill 0.35)
  Top 0.254: R4.2 R3.1 16.88,11.55 v17.27,11.94 | v26.42,16 27.55,16 U1.4
  Bottom 0.254: v17.27,11.94 21.34,16 v26.42,16
N$10
  Top 0.254: DCLD1.1 RLD1.2 7.25,37.71 LEDS.1
N$11
  Top 0.254: C3.2 24.65,13.59 U1.6
N$14  (via drill 0.35)
  Top 0.254: C8.1 70.61,10.57 72.18,12.14 72.2,12.14 U6.7 72.77,12.7 v71.12,12.7 | R5.2 68.07,14.99 v68.33,14.73
  Bottom 0.254: v68.33,14.73 70.36,12.7 v71.12,12.7
N$15  (via drill 0.35)
  Top 0.254: U6.8 72.89,8.38 72.14,7.62 72.02,7.74 C8.2 67.68,7.74 66.29,6.35 v62.23,6.35 | R6.2 63.89,15.63 60.45,12.19 v60.45,6.86
  Bottom 0.254: v60.45,6.86 60.96,6.35 v62.23,6.35
N$16
  Top 0.254: Q2.1 68.33,23.32 68.33,23.88 68.83,24.38 71.12,24.38 71.88,23.62 71.88,19.81 72.52,19.18 U6.2
N$18  (via drill 0.35)
  Top 0.254: 71.12,15.37 70.35,15.37 C7.1 67.45,13.09 66.8,12.45 66.8,9.14 66.04,8.38 R8.1 | 71.12,15.37 U6.5 | C6.2 63.87,20.71 v63.75,20.83 | v70.1,18.25 70.1,16.38 71.12,15.37
  Bottom 0.254: v63.75,20.83 64.77,19.81 69.09,19.81 70.1,18.8 v70.1,18.25
N$19  (via drill 0.35)
  Top 0.254: R8.2 R7.1 63.36,12.05 v64.01,12.7 | v71.37,16.51 72.77,16.51 U6.4
  Bottom 0.254: v64.01,12.7 67.82,16.51 v71.37,16.51
N$20
  Top 0.254: C7.2 70.88,14.1 U6.6
N$21
  Top 0.254: U4.5 43.45,39.61 OSC.1 DCO1.1
N$22
  Top 0.254: U4.6 43.43,39.11 OSC.2 DCO2.1
N$25  (via drill 0.35)
  Top 0.254: C12.1 47.5,10.67 49.28,12.45 | 49.28,12.45 49.66,12.83 U2.7 | R9.2 43.18,14.59 v43.18,13.97 | v48.01,12.7 48.26,12.45 49.28,12.45
  Bottom 0.254: v43.18,13.97 46.74,13.97 v48.01,12.7
N$26  (via drill 0.35)
  Top 0.254: U2.8 50.29,9.39 48.88,7.99 C12.2 45.5,5.99 41.13,5.99 40.73,5.59 v39.62,5.59 | R10.2 39.76,15.63 36.88,12.75 36.88,6.66 v36.93,6.6
  Bottom 0.254: v36.93,6.6 37.95,5.59 v39.62,5.59
N$27
  Top 0.254: Q3.1 45.21,23.32 45.21,23.88 45.47,24.13 45.47,24.38 48.77,24.38 49.28,23.88 49.28,19.56 49.66,19.18 U2.2
N$29  (via drill 0.35)
  Top 0.254: C11.1 44.76,13.15 | 44.76,13.15 46.98,15.37 47.24,15.37 | 47.24,15.37 U2.5 | C10.2 43.55,20.71 v44.2,20.07 | v46.74,16.76 46.74,15.88 47.24,15.37 | R12.1 42.42,8.13 43.43,9.14 43.43,12.45 44.14,13.15 44.76,13.15
  Bottom 0.254: v44.2,20.07 46.74,17.53 v46.74,16.76
N$30  (via drill 0.35)
  Top 0.254: R12.2 R11.1 39.49,12.31 v39.88,12.7 | v48.51,16.26 48.9,16.64 U2.4
  Bottom 0.254: v39.88,12.7 41.91,14.73 47.5,14.73 48.51,15.75 v48.51,16.26
N$31
  Top 0.254: C11.2 47.51,14.1 U2.6
N$32
  Top 0.254: DCLD2.1 RLD2.2 7.25,32.63 LEDS.3
N$33
  Top 0.254: DCLD3.1 RLD3.2 7.5,27.29 LEDS.5
N$34
  Top 0.61: VR3.4 72.2,57.86 BPV3.1
N$35
  Top 0.254: DCB1.1 RB1.2 6.47,43.3 BUTTPINS.1
N$36
  Top 0.254: DCB2.1 RB2.2 6.47,48.38 BUTTPINS.3
N$37
  Top 0.61: VR5.4 61.03,57.86 BPV5.1
N$38
  Top 0.254: DCB3.1 RB3.2 6.47,53.46 BUTTPINS.5
N$54  (via drill 0.35)
  Top 0.254: U6.11 78.36,14.22 76.71,14.22 v76.2,14.73 | v71.37,46.48 v71.37,51.31 | v52.83,51.05 52.83,50.04 52.32,49.53 52.32,43.12 U4.41
  Bottom 0.254: v76.2,14.73 71.37,19.56 v71.37,46.48 | v71.37,51.31 70.36,52.32 54.1,52.32 v52.83,51.05
N$55  (via drill 0.35)
  Top 0.254: U6.12 77.34,15.37 v76.71,16 | v72.28,46.48 72.28,49.64 v72.14,49.78 | v54.61,49.53 52.81,47.73 U4.40
  Bottom 0.254: v76.71,16 72.14,20.57 72.14,46.48 v72.28,46.48 | v72.14,49.78 70.53,49.78 69.87,50.44 55.52,50.44 v54.61,49.53
N$56  (via drill 0.35)
  Top 0.254: U1.11 33.41,13.46 v34.8,13.46 | v36.83,15.49 36.83,27.43 v33.78,30.48 | U4.39 53.34,43.14 53.34,44.2 v54.61,45.47
  Bottom 0.254: v34.8,13.46 v36.83,15.49 | v33.78,30.48 29.97,34.29 29.97,46.48 34.29,50.8 51.82,50.8 54.61,48.01 v54.61,45.47
N$57  (via drill 0.35)
  Top 0.254: U1.12 34.42,14.86 v34.54,14.99 | v45.72,26.16 47.75,26.16 49.28,27.69 49.28,27.94 49.53,28.19 50.6,28.19 53.26,30.86 53.26,32.77 52.31,33.72 U4.20
  Bottom 0.254: v34.54,14.99 v45.72,26.16
N$58  (via drill 0.35)
  Top 0.254: U2.11 56.01,14.22 v57.4,14.22 | U4.19 51.88,34.54 51.88,33.58 52.58,32.88 v52.58,32.51
  Bottom 0.254: v57.4,14.22 58.17,14.99 58.17,26.92 v52.58,32.51
N$59  (via drill 0.35)
  Top 0.254: U2.12 57.28,15.37 v57.4,15.24 | U4.18 51.31,32.51 v52.32,31.5
  Bottom 0.254: v57.4,15.24 57.66,15.49 57.66,26.16 v52.32,31.5
P3V  (via drill 0.35)
  Top 0.305: U4.24 54.8,34.61 | U4.48 48.49,43.43 | U4.9 46.56,37.61 46.15,38.02 46.05,38.02 v45.72,38.35
  Top 0.356: U4.36 55.86,41.66 57.4,41.66 | U4.1 47.27,41.66 45.97,41.66
  Top 0.61: PRGPIN.1 62.99,32.77 63.13,32.77 61.54,31.17 | 61.54,31.17 61.47,31.1 DCM24.2 56.27,31.1 v55.63,31.75 | U6.1 72.89,23.88 | 72.89,23.88 72.89,25 C5.1 | U6.16 78.49,21.84 77.22,23.11 73.65,23.11 72.89,23.88 | Q2.2 67.24,21.4 65.79,22.86 65.79,24.64 | 65.79,24.64 66.41,25.26 C5.1 | U2.1 50.29,23.88 | 50.29,23.88 C9.1 44.06,25.26 42.93,24.13 | U2.16 55.89,21.84 54.61,23.11 51.05,23.11 50.29,23.88 | Q3.2 44.13,21.4 42.93,22.61 42.93,24.13 | U1.1 27.69,22.86 | 27.69,22.86 C1.1 27.32,24.13 21.34,24.13 20.57,23.37 | U1.16 33.28,21.08 32.26,22.1 28.7,22.1 27.94,22.86 27.69,22.86 | Q1.2 22.03,20.13 20.57,21.59 | 20.57,21.59 20.57,23.37 | DCXB.1 4.06,16.26 5.59,14.73 XBEE.1 14.22,14.73 16.76,17.27 16.76,20.57 17.78,21.59 20.57,21.59 | v59.18,41.4 58.93,41.66 57.4,41.66 DCM36.2 | DCM1.2 45.47,42.16 45.97,41.66 45.72,41.4 v45.72,40.89 | v48.77,46.48 48.77,48.38 DCM48.2 R17.2 R16.2 21.34,55.88 v19.3,57.91 | 65.79,24.64 65.79,26.92 61.54,31.17 | 20.57,23.37 v20.57,26.16 | 42.93,24.13 v42.93,26.42 | VR3.5 75.69,58.83 DCV3.1 77.33,57.8 77.98,57.15 77.98,54.86 75.58,52.46 70.36,52.46 | 70.36,52.46 RSW.1 | v59.69,46.48 v59.69,49.02 | v69.6,49.78 69.6,51.7 70.36,52.46 | C5.1 75.3,25.26 v75.44,25.4 | 54.8,34.61 v55.37,34.04 | 48.49,43.43 v47.75,43.43 | DCM9.2 45.58,30.34 v45.72,30.48
  Bottom 0.61: v55.37,34.04 54.61,34.04 54.61,34.54 52.07,37.08 50.22,37.08 48.79,35.65 47.59,35.65 47.5,35.56 45.72,37.34 | v55.63,31.75 55.37,32 v55.37,34.04 | v55.37,34.04 56.22,34.04 56.3,33.96 57.08,33.96 58.67,35.56 58.67,40.89 v59.18,41.4 59.87,42.09 60.04,42.09 60.52,42.58 60.52,43.27 59.69,44.11 v59.69,46.48 | v45.72,40.89 45.72,39.37 | 45.72,39.37 v45.72,38.35 45.72,37.34 | v47.75,43.43 47.75,45.47 | 47.75,45.47 v48.77,46.48 | 47.75,45.47 46.99,45.47 44.45,42.93 44.45,40.64 45.72,39.37 | v20.57,26.16 22.35,27.94 43.18,27.94 | 43.18,27.94 v45.72,30.48 45.72,37.34 | v42.93,26.42 42.93,27.69 43.18,27.94 | v59.69,49.02 59.94,49.28 69.09,49.28 v69.6,49.78 | RFID.1 75.69,25.65 v75.44,25.4 | v19.3,57.91 13.72,63.5 13.72,73.91 LCDJMP.1
P5V  (via drill 0.35)
  Top 0.61: DCV5.1 64.26,59.85 | 64.26,59.85 VR5.5 | 64.26,59.85 63.15,59.85 v62.74,59.44 | v54.36,59.44 54.22,59.3 DCLCD.2 46.11,59.3 36.58,68.83 | 36.58,68.83 32.89,68.83 U5.16 | 36.58,68.83 v34.8,70.61
  Bottom 0.61: v62.74,59.44 59.44,59.44 v54.36,59.44 | v34.8,70.61 28.47,76.94 LCDPINS.11 28.47,74.45 25.4,71.37 LCDJMP.3
POT_A  (via drill 0.35)
  Top 0.254: U5.7 25.78,61.09 28.7,58.17 v34.29,58.17 | v46.99,62.23 VR1.1
  Bottom 0.254: v34.29,58.17 42.93,58.17 v46.99,62.23
POT_B  (via drill 0.35)
  Top 0.254: VR1.2 v49.53,64.77 | LCDPINS.10 31.01,72.92 v30.99,72.9
  Bottom 0.254: v49.53,64.77 44.7,64.77 41.66,61.72 39.12,61.72 30.99,69.85 v30.99,72.9
PWR_IN  (via drill 0.35)
  Top 0.61: 74.15,68.31 74.15,63.07 VR3.1 | v70.61,65.02 63.75,65.02 62.93,64.2 VR5.1 | v72.9,67.06 74.15,68.31 | J1.2 74.15,69.2 74.15,68.31
  Bottom 0.61: v70.61,65.02 70.87,65.02 v72.9,67.06
RS
  Top 0.254: U5.4 24.51,64.9 33.55,73.94 LCDPINS.9
RST  (via drill 0.35)
  Top 0.254: 61.72,42.93 v59.69,42.93 | 61.72,42.93 62.99,42.93 PRGPIN.5 | S1.1 60.2,50.29 60.96,49.53 | 61.72,42.93 60.96,43.69 60.96,49.53 | 60.96,49.53 62.09,50.66 DCSW.2 RSW.2 | U4.7 48.2,38.61 48.27,38.68 48.34,38.68 48.59,38.94 v49.75,38.94
  Bottom 0.254: v59.69,42.93 55.63,38.86 49.82,38.86 v49.75,38.94
RW
  Top 0.254: U5.5 24.51,63.63 36.09,75.21 LCDPINS.8
RX  (via drill 0.35)
  Top 0.254: XBEE.3 11.18,19.81 21.34,29.97 v22.61,29.97 | v44.45,32.26 47.75,32.26 48.81,33.32 U4.13
  Bottom 0.254: v22.61,29.97 22.76,29.82 41,29.82 43.43,32.26 v44.45,32.26
SCL  (via drill 0.35)
  Top 0.254: U4.42 51.81,54.5 R16.1 50.43,56.25 49.28,57.4 v31.75,57.4 | U5.14 31.88,66.17 30.73,65.02 v30.73,62.99
  Bottom 0.254: v31.75,57.4 30.73,58.42 v30.73,62.99
SDA  (via drill 0.35)
  Top 0.254: U4.43 51.31,43.86 51.4,43.94 51.4,51.36 R17.1 50.43,53.71 v50.04,54.1 | v29.72,64.77 29.72,66.04 31.11,67.44 U5.15
  Bottom 0.254: v50.04,54.1 33.78,54.1 29.72,58.17 v29.72,64.77
SWCLK  (via drill 0.35)
  Top 0.254: U4.37 54.36,43.07 54.36,44.11 55.42,45.17 55.59,45.17 v56.13,45.72 | PRGPIN.2 60.71,38.1 v60.71,39.37 | v60.71,41.4 59.84,42.27 59.42,42.27 58.67,43.01 v58.67,45.72
  Bottom 0.254: v60.71,39.37 v60.71,41.4 | v58.67,45.72 v56.13,45.72
SWDIO
  Top 0.254: U4.34 63.22,40.61 PRGPIN.4
TX  (via drill 0.35)
  Top 0.254: XBEE.2 10.41,17.27 22.1,28.96 v22.86,28.96 | v42.67,28.96 43.69,29.97 43.69,34.54 45.26,36.11 U4.12
  Bottom 0.254: v22.86,28.96 v42.67,28.96

### Text on the board
tPlace: VSS | VDD | VO | RS | RW | E | D4 | D5 | D6 | D7 | A | K | 3.3 V | 5 V | 1 | 2 | GND | MOSI | 3 | RST | MISO | Royal Flush ID / Team 21 / Central Hub / v1.0 | SWDIO | SCK | 1 | GND | SDA | SWCLK | 3.3 V | 2 | 3.3 V | 3 | GND | RX | TX | 3.3 V | A+ | A- | E- | E+ | A+ | A- | E- | E+ | A+ | A- | E- | E+